# EAGLE schematic Ex 9BlueLed1RedLedPanel (EAGLE 7.6.0)
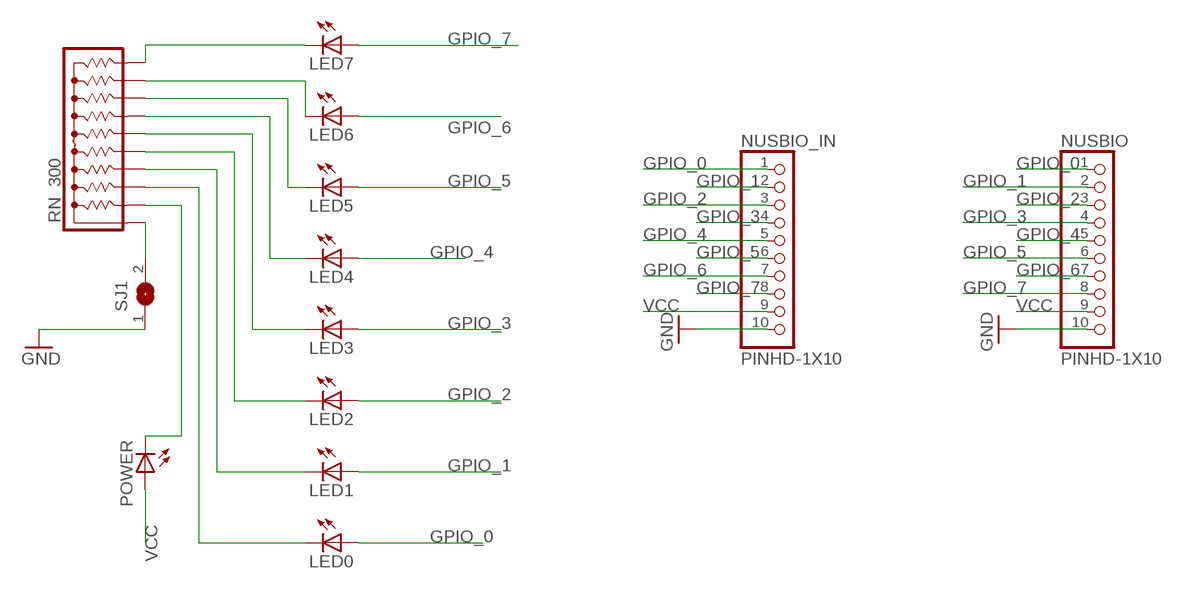
[diagram p0: schematic, sheet 1]

## Parts
LED0  LEDSMT1206  [1206]
LED1  LEDSMT1206  [1206]
LED2  LEDSMT1206  [1206]
LED3  LEDSMT1206  [1206]
LED4  LEDSMT1206  [1206]
LED5  LEDSMT1206  [1206]
LED6  LEDSMT1206  [1206]
LED7  LEDSMT1206  [1206]
NUSBIO  PINHD-1X10  [1X10-BIG]
NUSBIO_IN  PINHD-1X10  [1X10-BIG]
POWER  LEDSMT1206  [1206]
RN_300  4610X  [SIP10]
SJ1  SOLDERJUMPERREFLOW_NOPASTE  [SOLDERJUMPER_REFLOW_NOPASTE]

## Nets
GND: NUSBIO.10 NUSBIO_IN.10 SJ1.1
GPIO_0: LED0.A NUSBIO.1 NUSBIO_IN.1
GPIO_1: LED1.A NUSBIO.2 NUSBIO_IN.2
GPIO_2: LED2.A NUSBIO.3 NUSBIO_IN.3
GPIO_3: LED3.A NUSBIO.4 NUSBIO_IN.4
GPIO_4: LED4.A NUSBIO.5 NUSBIO_IN.5
GPIO_5: LED5.A NUSBIO.6 NUSBIO_IN.6
GPIO_6: LED6.A NUSBIO.7 NUSBIO_IN.7
GPIO_7: LED7.A NUSBIO.8 NUSBIO_IN.8
N$1: POWER.C RN_300.2
N$2: RN_300.1 SJ1.2
N$3: LED7.C RN_300.10
N$4: LED6.C RN_300.9
N$5: LED5.C RN_300.8
N$6: LED4.C RN_300.7
N$7: LED3.C RN_300.6
N$8: LED2.C RN_300.5
N$9: LED1.C RN_300.4
N$10: LED0.C RN_300.3
VCC: NUSBIO.9 NUSBIO_IN.9 POWER.A

## Library data of the parts
LED0 LED1-LED7 POWER = adafruit:LED: LED OSRAM: - CHIPLED LG R971, LG N971, LY N971, LG Q971, LY Q971, LO R971, LY R971 LH N974, LH R974 LS Q976, LO Q976, LY Q976 LO Q996 - Hyper CHIPLED LW Q18S LB Q993, LB Q99A, LB R99A - SideLED LS A670, LO A670, LY A670, LG A670, LP A670 LB A673, LV A673, LT A673, LW A673 LH A674 LY A675 LS A676, LA A676, LO A676, LY A676, LW A676 LS A679, LY A679, LG A679 - Hyper Micro SIDELED® LS Y876, LA Y876, LO Y876, LY Y876 LT Y87S - SmartLED LW L88C, LW L88S LB L89C, LB L89S, LG L890 LS L89K, LO L89K, LY L89K LS L896, LA L896, LO L896, LY L896 - TOPLED LS T670, LO T670, LY T670, LG T670, LP T670 LSG T670, LSP T670, LSY T670, LOP T670, LYG T670 LG T671, LOG T671, LSG T671 LB T673, LV T673, LT T673, LW T673 LH T674 LS T676, LA T676, LO T676, LY T676, LB T676, LH T676, LSB T676, LW T676 LB T67C, LV T67C, LT T67C, LS T67K, LO T67K, LY T67K, LW E67C LS E67B, LA E67B, LO E67B, LY E67B, LB E67C, LV E67C, LT E67C LW T67C LS T679, LY T679, LG T679 LS T770, LO T770, LY T770, LG T770, LP T770 LB T773, LV T773, LT T773, LW T773 LH T774 LS E675, LA E675, LY E675, LS T675 LS T776, LA T776, LO T776, LY T776, LB T776 LHGB T686 LT T68C, LB T68C - Hyper Mini TOPLED® LB M676 - Mini TOPLED Santana® LG M470 LS M47K, LO M47K, LY M47K Source: http://www.osram.convergy.de/
NUSBIO NUSBIO_IN = adafruit:PINHD-1X10: Pin header 1x10 0.1" spacing With round pins
RN_300 = resistor-sip:4610X: Bourns 4600X Series - Thick Film Conformal SIPs 4610X-101 Resistor Network Configuration: 101 (Bussed Resistors) Resistance range: 10 ohms to 10 Megaohms Maximum Operating Voltage: 100V Source: http://www.bourns.com/ProductLine.aspx?name=standard_thick_film_networks PDF: http://www.bourns.com/data/global/pdfs/4600X.pdf
SJ1 = microbuilder:SOLDERJUMPER: SMD Solder JUMPER Solder the two pads together to create a connection, or remove the solder to break it. REFLOW - Use this footprint for solder paste and reflow ovens. WAVE - Use this footprint for hand-soldering (larger pads). CLOSED - Has a trace between the two pads to ensure it is closed by default. The trace needs to be cut to disable the jumper, and can be closed again by creating a solder bridge between the two pads.